# Altium schematic sheet Challenge1.SchDoc
size A; Organization: Husky Robotics; Address1: University of Washington; Address2: Mechanical Engineering; Address3: Seattle, WA
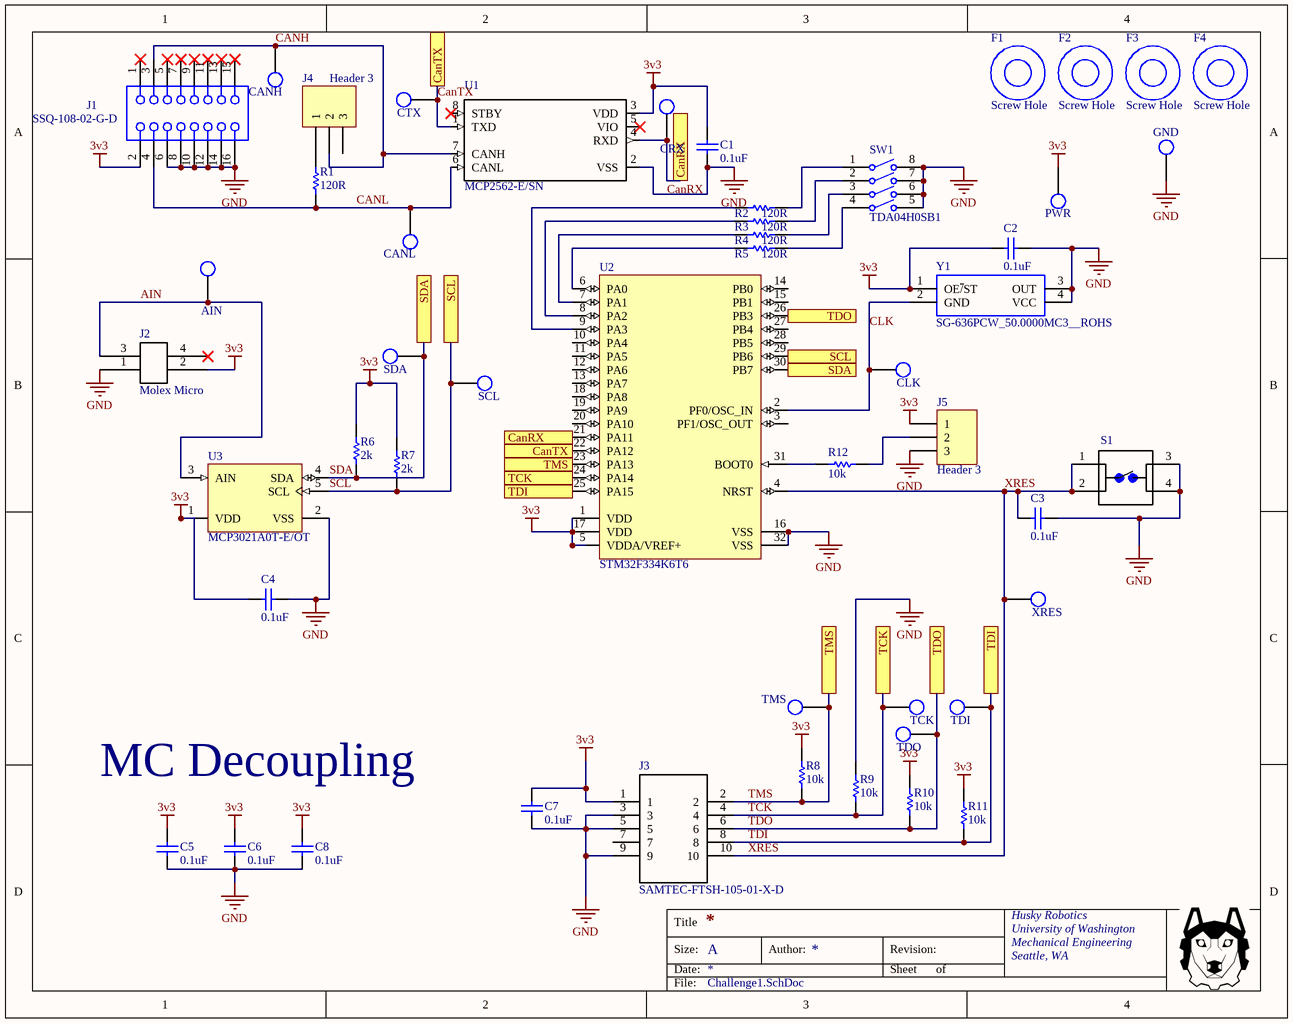
[diagram p0: Challenge1.SchDoc]

## Parts
AIN  Test Point  [Test Point Through-hole]  (value not drawn)
C1  0.1uF  [CAPC0805(2012)100_M]
C2  0.1uF  [CAPC0805(2012)100_M]
C3  0.1uF  [CAPC0805(2012)100_M]
C4  0.1uF  [CAPC0805(2012)100_M]
C5  0.1uF  [CAPC0805(2012)100_M]
C6  0.1uF  [CAPC0805(2012)100_M]
C7  0.1uF  [CAPC0805(2012)100_M]
C8  0.1uF  [CAPC0805(2012)100_M]
CANH  Test Point  [Test Point Through-hole]  (value not drawn)
CANL  Test Point  [Test Point Through-hole]  (value not drawn)
CLK  Test Point  [Test Point Through-hole]  (value not drawn)
CRX  Test Point  [Test Point Through-hole]  (value not drawn)
CTX  Test Point  [Test Point Through-hole]  (value not drawn)
F1  Screw Hole  [Screw Hole]
F2  Screw Hole  [Screw Hole]
F3  Screw Hole  [Screw Hole]
F4  Screw Hole  [Screw Hole]
GND  Test Point  [Test Point Through-hole]  (value not drawn)
J1  SSQ-108-02-G-D  [SMTC-SSQ-108-02-X-D]
J2  Molex Micro  [0430450427]
J3  SAMTEC-FTSH-105-01-X-D  [SAMTEC-FTSH-105-01-X-D]
J4  Header 3  [HDR1X3]
J5  Header 3  [HDR1X3]
PWR  Test Point  [Test Point Through-hole]  (value not drawn)
R1  120R  [RESC0805(2012)_N]
R2  120R  [RESC0805(2012)_N]
R3  120R  [RESC0805(2012)_N]
R4  120R  [RESC0805(2012)_N]
R5  120R  [RESC0805(2012)_N]
R6  2k  [RESC0805(2012)_N]
R7  2k  [RESC0805(2012)_N]
R8  10k  [RESC0805(2012)_N]
R9  10k  [RESC0805(2012)_N]
R10  10k  [RESC0805(2012)_N]
R11  10k  [RESC0805(2012)_N]
R12  10k  [RESC0805(2012)_N]
S1  1825910-7  [Switch 6mm 24V (NO)]  (value not drawn)
SCL  Test Point  [Test Point Through-hole]  (value not drawn)
SDA  Test Point  [Test Point Through-hole]  (value not drawn)
SW1  TDA04H0SB1  [CKCP-TDA04H0SB1R_V]
TCK  Test Point  [Test Point Through-hole]  (value not drawn)
TDI  Test Point  [Test Point Through-hole]  (value not drawn)
TDO  Test Point  [Test Point Through-hole]  (value not drawn)
TMS  Test Point  [Test Point Through-hole]  (value not drawn)
U1  MCP2562-E/SN  [SOIC127P600X175-8N]
U2  STM32F334K6T6  [STM-LQFP32_N]
U3  MCP3021A0T-E/OT  [SOT-23-OT5_M]
XRES  Test Point  [Test Point Through-hole]  (value not drawn)
Y1  SG-636PCW_50.0000MC3__ROHS  [SG-636]

## Ports
CanRX, CanTX, SCL, SDA, TCK, TDI, TDO, TMS

## Nets
3v3: C1.1 C2.1 C4.1 C5.1 C6.1 C7.1 C8.1 J1.2 J2.2 J3.1 J5.1 PWR.1 R6.2 R7.2 R8.2 R10.2 R11.2 U1.3(VDD) U2.1(VDD) U2.5(VDDA/VREF+) U2.17(VDD) U3.1(VDD) Y1.1(OE~{/}ST)
GND: C1.2 C2.2 C3.2 C4.2 C5.2 C6.2 C7.2 C8.2 GND.1 J1.6 J1.8 J1.10 J1.12 J1.14 J1.16 J2.1 J3.3 J3.5 J3.9 J5.3 R9.2 S1.3 S1.4 SW1.5 SW1.6 SW1.7 SW1.8 U1.2(VSS) U2.16(VSS) U2.32(VSS) U3.2(VSS) Y1.3(OUT) Y1.4(VCC)
AIN: AIN.1 J2.3 U3.3(AIN)
CANH: CANH.1 J1.3 J4.2 U1.7(CANH)
CANL: CANL.1 J1.4 R1.1 U1.6(CANL)
CanRX: CRX.1 U1.4(RXD) U2.21(PA11) ; port CanRX
CanTX: CTX.1 U1.1(TXD) U2.22(PA12) ; port CanTX
CLK: CLK.1 U2.2(PF0/OSC_IN) Y1.2(GND)
SCL: R7.1 SCL.1 U2.29(PB6) U3.5(SCL) ; port SCL
SDA: R6.1 SDA.1 U2.30(PB7) U3.4(SDA) ; port SDA
TCK: J3.4 R9.1 TCK.1 U2.24(PA14) ; port TCK
TDI: J3.8 R11.1 TDI.1 U2.25(PA15) ; port TDI
TDO: J3.6 R10.1 TDO.1 U2.26(PB3) ; port TDO
TMS: J3.2 R8.1 TMS.1 U2.23(PA13) ; port TMS
XRES: C3.1 J3.10 S1.1 S1.2 U2.4(NRST) XRES.1
NetJ4_1: J4.1 R1.2
NetJ5_2: J5.2 R12.1
NetR2_1: R2.1 SW1.1
NetR2_2: R2.2 U2.9(PA3)
NetR3_1: R3.1 SW1.2
NetR3_2: R3.2 U2.8(PA2)
NetR4_1: R4.1 SW1.3
NetR4_2: R4.2 U2.7(PA1)
NetR5_1: R5.1 SW1.4
NetR5_2: R5.2 U2.6(PA0)
NetR12_2: R12.2 U2.31(BOOT0)

Not connected (* = marked no-connect by the designer): J1 1* 5* 7* 9* 11* 13* 15*; J2 4*; J3 7; J4 3; U1 5(VIO)* 8(STBY)*; U2 3(PF1/OSC_OUT) 10(PA4) 11(PA5) 12(PA6) 13(PA7) 14(PB0) 15(PB1) 18(PA8) 19(PA9) 20(PA10) 27(PB4) 28(PB5)

## Notes on the sheet
- MC Decoupling
- Title
- Size:
- Date:
- A
- Author:
- Revision:
- Sheet
- of
- File:

## Library data of the parts
C1-C8 = CMP-1036-01451-1: CAP 33pF 200V ±1% 0805 (2012 Metric) Thickness 1mm SMD; Tolerance: Â±1%; Case-EIA: 0805; Case-Metric: 2012; Technology: SMT; Rated Voltage: 200 V; Max Thickness: 1 mm; Value: 33pF
F1-F4 = Screw Hole: Add 4 of these to your design for screw hole mounting
J1 = CMP-1023-00300-1: SQ Post Socket, Through-hole, Vertical, -55 to 125 degC, 2.54 mm Pitch, 16-Pin, Female, RoHS; Manufacturer: Samtec; Pitch: 2.54 mm; ComponentLink2URL: http://www.samtec.com/documents/webfiles/pdf/SSQ_TH.PDF; ComponentLink3Description: Package Specification; Mounting Technology: Through-hole; RoHS: True; PackageReference: SSQ-108-02-X-D; PartNumber: SSQ-108-02-G-D; Orientation: Vertical; ComponentLink1URL: http://www.samtec.com; DatasheetVersion: F-214; Temperature Range: -55 to 125 degC; PackageDescription: Assembly, Socket Strip .025[0.64] SQ Tail; PackageVersion: BD, 6/1987; ComponentLink2Description: Datasheet; ComponentLink1Description: Manufacturer URL; ComponentLink3URL: http://www.samtec.com/documents/webfiles/cpdf/SSQ-1XX-XX-XXX-X-XX-XXX-XX-X-MKT.pdf
J2 = Molex micro-fit 4-pin (dual row schematic): Molex micro-fit 3.0, P/N 0430450427
J4 J5 = Header 3: Header, 3-Pin; LatestRevisionDate: 17-Jul-2002; LatestRevisionNote: Re-released for DXP Platform.; Publisher: Altium Limited
R1-R12 = 120R 5% 0805: 120R 0.125W 5% 0805 (2012 Metric)  SMD; Case-Metric: 2012; Value: 120.00 Ohm; Case-EIA: 0805; Tolerance: 5 %; Technology: SMT; Power: 0.125 W
S1 = Switch 6mm 24V (NO): FSM4JAH=6MM TACT SWITCH, HIGH TEMP; MF: TE Connectivity; Contact_Current_Rating: 50 mA; Configuration_Pole-Throw: Single Pole - Single Throw; Package: None; Digi-Key_Part_Number: 450-1804-ND; Digi-Key_Purchase_URL: https://www.digikey.com/product-detail/en/te-connectivity-alcoswitch-switches/1825910-7/450-1804-ND/1731414?utm_source=snapeda&utm_medium=aggregator&utm_campaign=symbol; MP: 1825910-7; SnapEDA_Link: https://www.snapeda.com/parts/1825910-7/TE%20Connectivity%20ALCOSWITCH%20Switches/view-part/?ref=snap; EU_RoHS_Compliance: Compliant; TE_purchase_URL: https://www.te.com/usa-en/product-1825910-7.html?te_bu=Cor&te_type=disp&te_campaign=seda_glo_cor-seda-global-disp-prtnr-fy19-seda-model-bom-cta_sma-317_1&elqCampaignId=32493; Value: *
SW1 = Dip Switch Array SMD Half-Pitch: Ultra-Miniature Surface Mount Half-Pitch DIP Switch, 25 mA, 24 V, -40 to 85 degC, 8-Pin SMD, RoHS, Tube; Contact Current Rating: 100 mA; Throw Configuration: SPST; Voltage Rating (DC): 24 V; Max Contact Resistance: 100 mohm; Max Current Rating: 25 mA; REACH SVHC: No SVHC; DatasheetVersion: 02/2016; Case\Package: DIP; Package Quantity: 70; Lead Pitch: 1.27 mm; Contact Plating: Gold; Packaging: Rail/Tube; Contact Finish: Gold; Mount: Surface Mount; Height: 2.3 mm; Contact Material: Copper; Max Operating Temperature: 85 degC; Max Voltage Rating (DC): 24 V; ComponentLink1URL: http://www.ck-components.com/media/1328/tda.pdf; PackageDescription: 8-Pin Surface Mount Device, Body 6.21 x 6.2 mm, Pitch 1.27 mm; Radiation Hardening: No; ComponentLink1Description: Datasheet; Current Rating: 100 mA; RoHSCompliant: true; PackageReference: TDA04H0SB1R; Min Operating Temperature: -40 degC; Pins: 4; Mounting Technology: Surface Mount; Length: 6.21 mm
U1 = CAN Tranceiver: Microchip MCP2562-E/SN, CAN Transceiver 1MBps 1-channel IEC 61000-4-2, 8-Pin SOIC; Price: None; MF: Microchip; SnapEDA_Link: https://www.snapeda.com/parts/MCP2562-E/SN/Microchip/view-part/?ref=snap; MP: MCP2562-E/SN; Availability: Unavailable; Package: SO-8 Microchip; Value: *
U2 = STM32F334K6T6: ARM Cortex-M4 32-bit MCU, 32-Pin LQFP, 32 KB Flash, 16 KB Internal RAM, 25 I/Os, -40 to 85 degC, Tray; D/A Converter: 3; Internal RAM Size (kB): 16; I/Os (High Current): 25; Supply Voltage(Vcc) min (V): 2; Operating Frequency(F) (Processor speed) (MHz): 72; FLASH Size (Prog) (kB): 32; ComponentLink1Description: Manufacturer URL; Mounting Technology: Surface Mount; ComponentLink1URL: http://www.st.com/; Package Description: 32-Pin Low Profile Quad Flat Package, 7 x 7 mm Body, 0.8 mm Pitch; ComponentLink2URL: http://www.st.com/st-web-ui/static/active/en/resource/technical/document/datasheet/DM00097745.pdf; Packing: Tray; Package Reference: LQFP32; Core: ARM Cortex-M4; ComponentLink2Description: Datasheet; DatasheetVersion: Rev. 4
U3 = CMP-0188-01214-1: Low Power 10-Bit A/D Converter With I2C Interface, 5-Pin SOT-23, Extended Temperature, Tape and Reel; ComponentLink1Description: Manufacturer URL; PackageVersion: revBB, Aug-2009; ComponentLink1URL: http://www.microchip.com/; ComponentLink2URL: http://ww1.microchip.com/downloads/en/DeviceDoc/21805a.pdf; ComponentLink2Description: Datasheet; PackageReference: SOT-23-OT5; ComponentLink3Description: Package Specification; Code_IPC: SOT23-5; DatasheetVersion: revA, May-2003; PackageDescription: 5-Lead Plastic Small Outline Transistor (OT) [SOT-23]; ComponentLink3URL: http://www.microchip.com/stellent/groups/techpub_sg/documents/packagingspec/en012702.pdf
Y1 = Oscilator: Standard Clock Oscillators; Manufacturer_Name: Epson Timing; Manufacturer_Part_Number: SG-636PCW 50.0000MC3: ROHS; RS Part Number: *; RS Price/Stock: *; Arrow Part Number: SG-636PCW 50.0000MC3: ROHS; Arrow Price/Stock: *; Datasheet Link: http://www.mouser.com/ds/2/137/G-636PCE_en-1003252.pdf